# EAGLE design CurrentMeasureOscilloscopeRev.01A  (EAGLE 9.6.2)
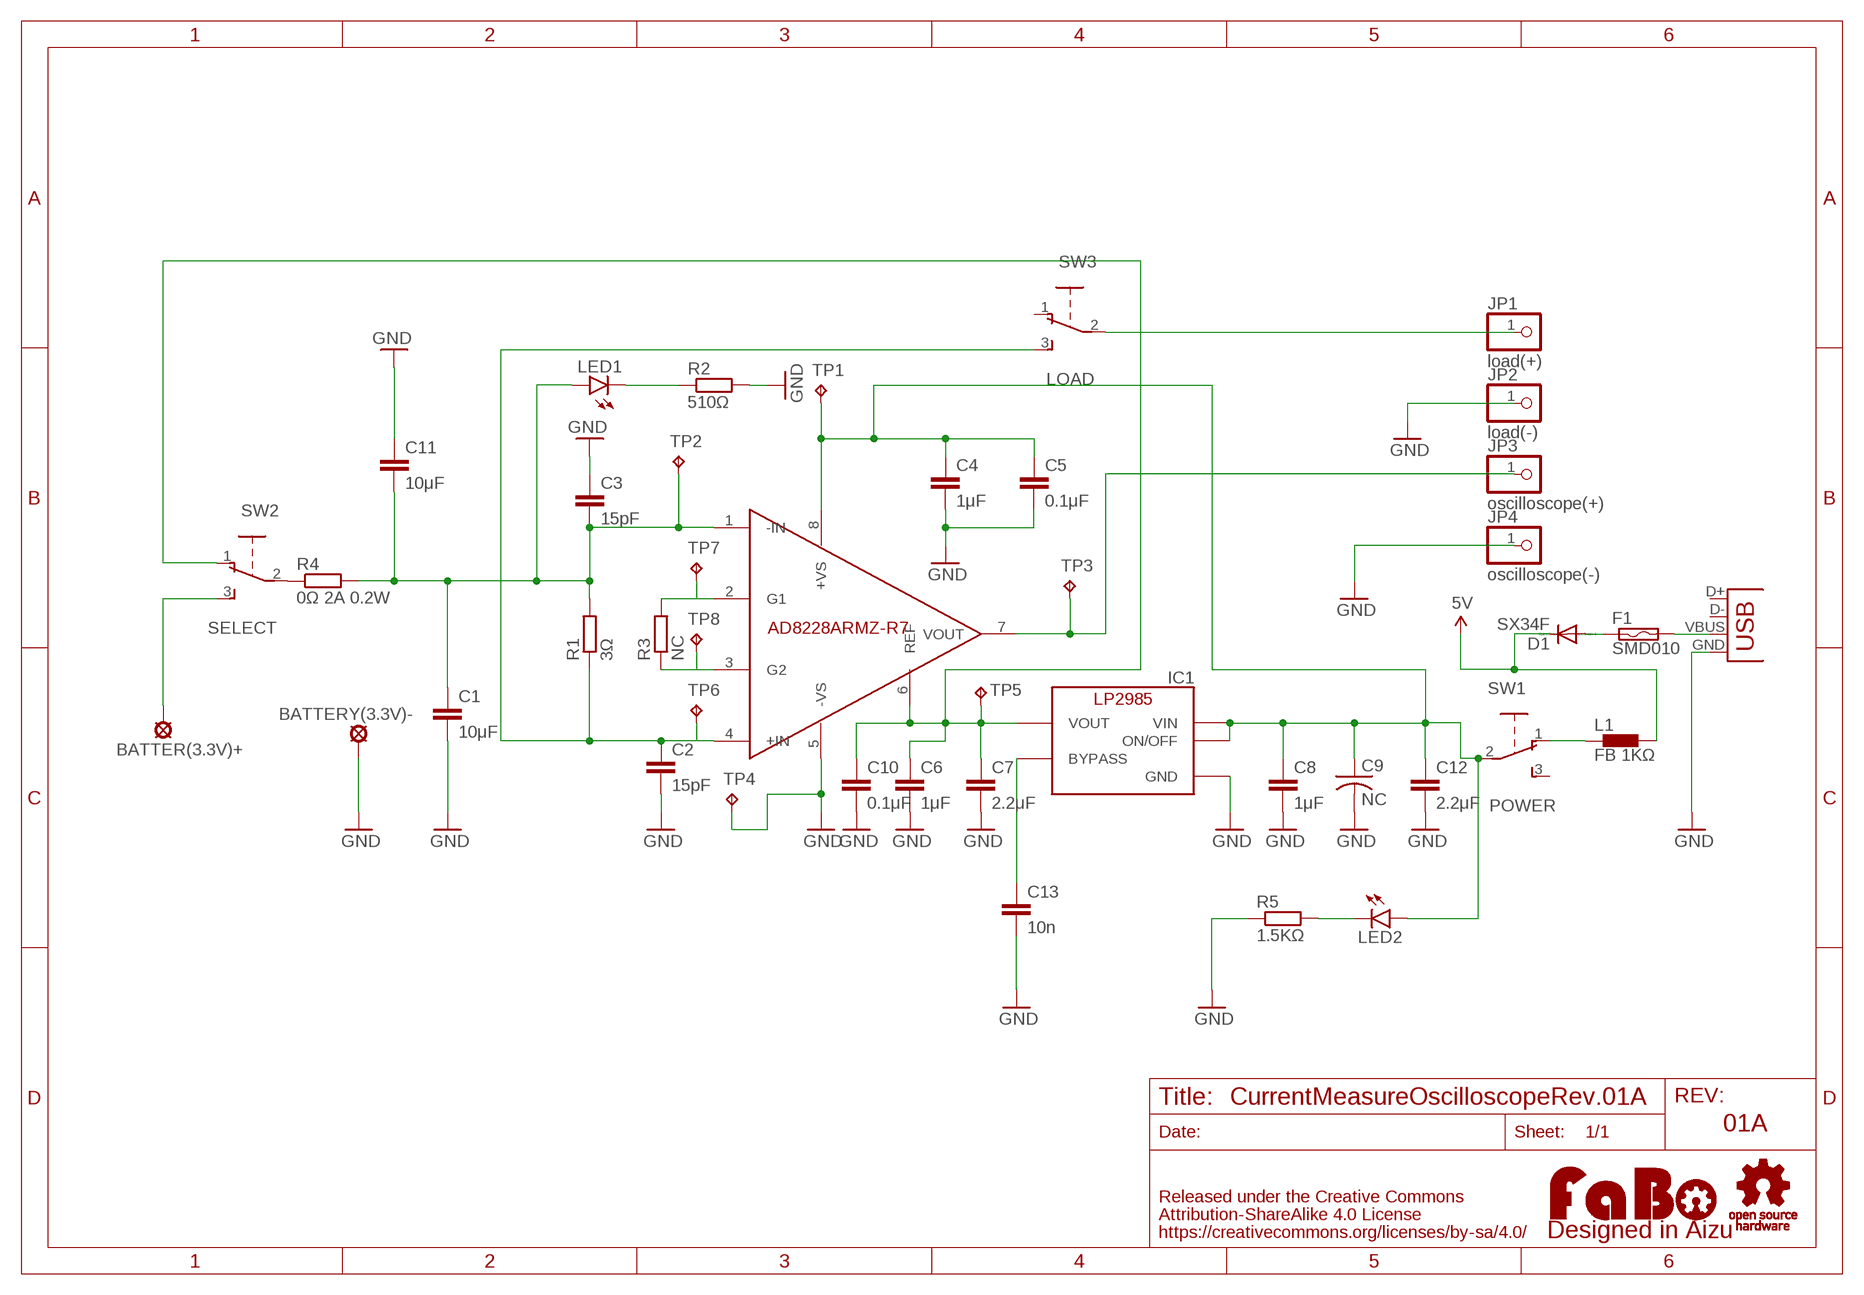
[diagram p0: schematic, sheet 1]

## Parts
BATTER(3.3V)+  SE14  [SE14]
BATTERY(3.3V)-  SE14  [SE14]
C1  10μF  C-EUC0805  [C0805]
C2  15pF  C-EUC0402  [C0402]
C3  15pF  C-EUC0402  [C0402]
C4  1μF  C-EUC0603  [C0603]
C5  0.1μF  C-EUC0402  [C0402]
C6  1μF  C-EUC0805  [C0805]
C7  2.2μF  C-EUC1206K  [C1206K]
C8  1μF  C-EUC0805  [C0805]
C9  NC  C-USC2012  [C2012]
C10  0.1μF  C-EUC0402  [C0402]
C11  10μF  C-EUC0805  [C0805]
C12  2.2μF  C-EUC1206K  [C1206K]
C13  10n  C-EUC2012  [C2012]
D1  SX34F  DIODE-SOD106-R  [SOD106-R]
F1  SMD010  [SMD010]
IC1  TI-LP2985-33DBVR  [TI-LP2985]
JP1  load(+)  PINHD-1X1  [1X01]
JP2  load(-)  PINHD-1X1  [1X01]
JP3  oscilloscope(+)  PINHD-1X1  [1X01]
JP4  oscilloscope(-)  PINHD-1X1  [1X01]
JP5  USB-B-MICRO_SMD  [USB_B_MICRO]
L1  FB 1KΩ  BLM15HB121SN1  [0402]
LED1  LED-EIA0603  [EIA0603-LED]
LED2  LED-EIA0603  [EIA0603-LED]
R1  3Ω  R-EU_M1206  [M1206]
R2  510Ω  R-EU_R0402  [R0402]
R3  NC  R-EU_M1206  [M1206]
R4  0Ω 2A 0.2W  R-EU_R0402  [R0402]
R5  1.5KΩ  R-EU_R0603  [R0603]
SW1  POWER  SWITCH-SLIDE-EG1218  [EG1218]
SW2  SELECT  SWITCH-SLIDE-EG1218  [EG1218]
SW3  LOAD  SWITCH-SLIDE-EG1218  [EG1218]
TP1  TPTP13R  [TP13R]
TP2  TPTP13R  [TP13R]
TP3  TPTP13R  [TP13R]
TP4  TPTP13R  [TP13R]
TP5  TPTP13R  [TP13R]
TP6  TPTP13R  [TP13R]
TP7  TPTP13R  [TP13R]
TP8  TPTP13R  [TP13R]
U1  AD8228ADZY  [MSOP08]
U$2  LOGO_OSHW-M_BOTTOM  [LOGO_OSHW_M_BOTTOM]
U$3  LOGO_FABO-M  [LOGO_FABO_MS]

## Nets
5V: D1.C L1.2
GND: BATTERY(3.3V)-.MP C1.2 C2.2 C3.1 C4.2 C5.2 C6.2 C7.2 C8.2 C9.2 C10.2 C11.1 C12.2 C13.2 IC1.2(GND) JP2.1 JP4.1 JP5.GND R2.2 R5.1 TP4.TP U1.5(-VS)
N$1: C1.1 C3.2 C11.2 LED1.A R1.2 R4.2 TP2.TP U1.1(-IN)
N$2: C4.1 C5.1 C8.1 C9.1 C12.1 IC1.1(VIN) IC1.3(ON/OFF) LED2.A SW1.2 TP1.TP U1.8(+VS)
N$3: C2.1 R1.1 SW3.3 TP6.TP U1.4(+IN)
N$4: LED1.C R2.1
N$5: JP3.1 TP3.TP U1.7(VOUT)
N$6: R3.2 TP7.TP U1.2(G1)
N$7: R3.1 TP8.TP U1.3(G2)
N$8: BATTER(3.3V)+.MP SW2.3
N$9: JP1.1 SW3.2
N$10: R4.1 SW2.2
N$11: C6.1 C7.1 C10.1 IC1.5(VOUT) SW2.1 TP5.TP U1.6(REF)
N$12: C13.1 IC1.4(BYPASS)
N$13: LED2.C R5.2
N$15: L1.1 SW1.1
N$17: D1.A F1.P$1
N$18: F1.P$2 JP5.VBUS
Unconnected: JP5.D+ JP5.D- SW1.3 SW3.1

## Notes on the sheet
- AD8228ARMZ-R7
- 01A

## Library data of the parts
BATTER(3.3V)+ BATTERY(3.3V)- = solpad:SE14: SOLDER PAD E1553, drill 1,4mm, distributor Buerklin, 07F820
C1-C8 C10-C13 = rcl:C-EU: CAPACITOR, European symbol
C9 = rcl:C-US: CAPACITOR, American symbol
D1 = diode:DIODE-: DIODE
F1 = switch-raychem:SMD010
IC1 = FaBo-Supply:TI-LP2985: LP2985
JP1-JP4 = pinhead:PINHD-1X1: PIN HEADER
JP5 = FaBo-etc:USB: USB Female
L1 = inductors:BLM15H: EMIFIL (R) Chip Ferrite Bead for GHz Noise Source: http://www.murata.com/ Ferrite Bead BLM15H.pdf
LED1 LED2 = FaBo-etc:LED: LED
R1-R4 = rcl:R-EU_: RESISTOR, European symbol
R5 = resistor:R-EU_: RESISTOR, European symbol
SW1-SW3 = FaBo-etc:SWITCH-SLIDE
TP1-TP8 = testpad:TP: Test pad
U1 = analog-devices:AD8228ADZY
U$2 = FaBo-Logo:LOGO_OSHW
U$3 = FaBo-Logo:LOGO_FABO

## Board
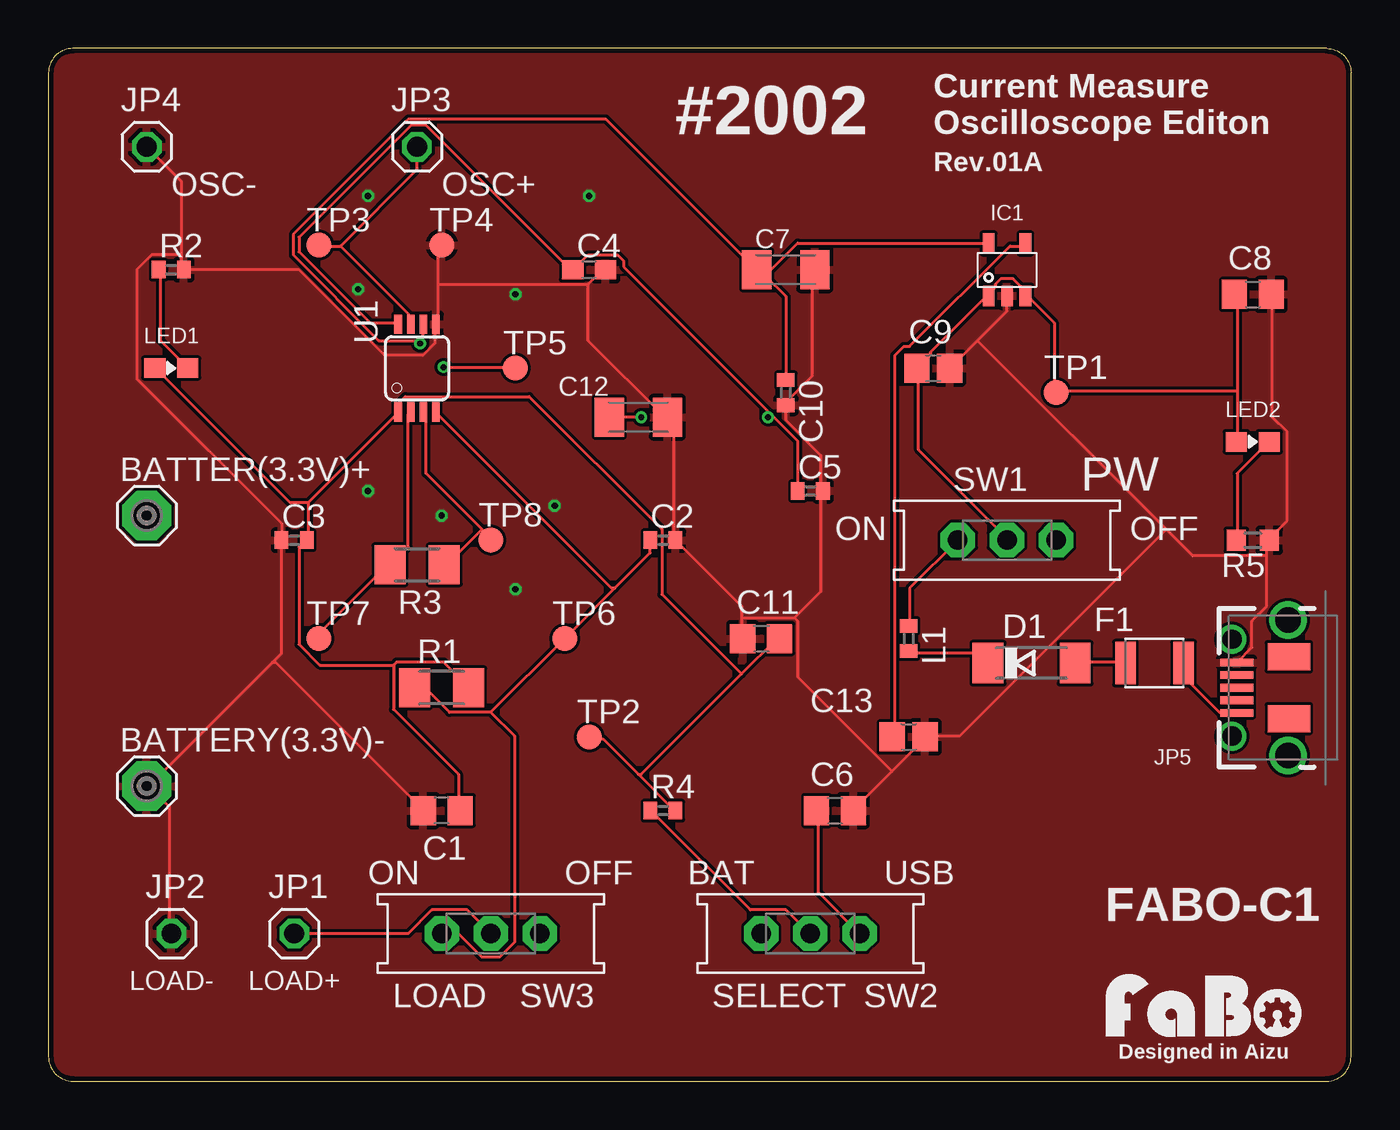
[diagram p1: board, top side]
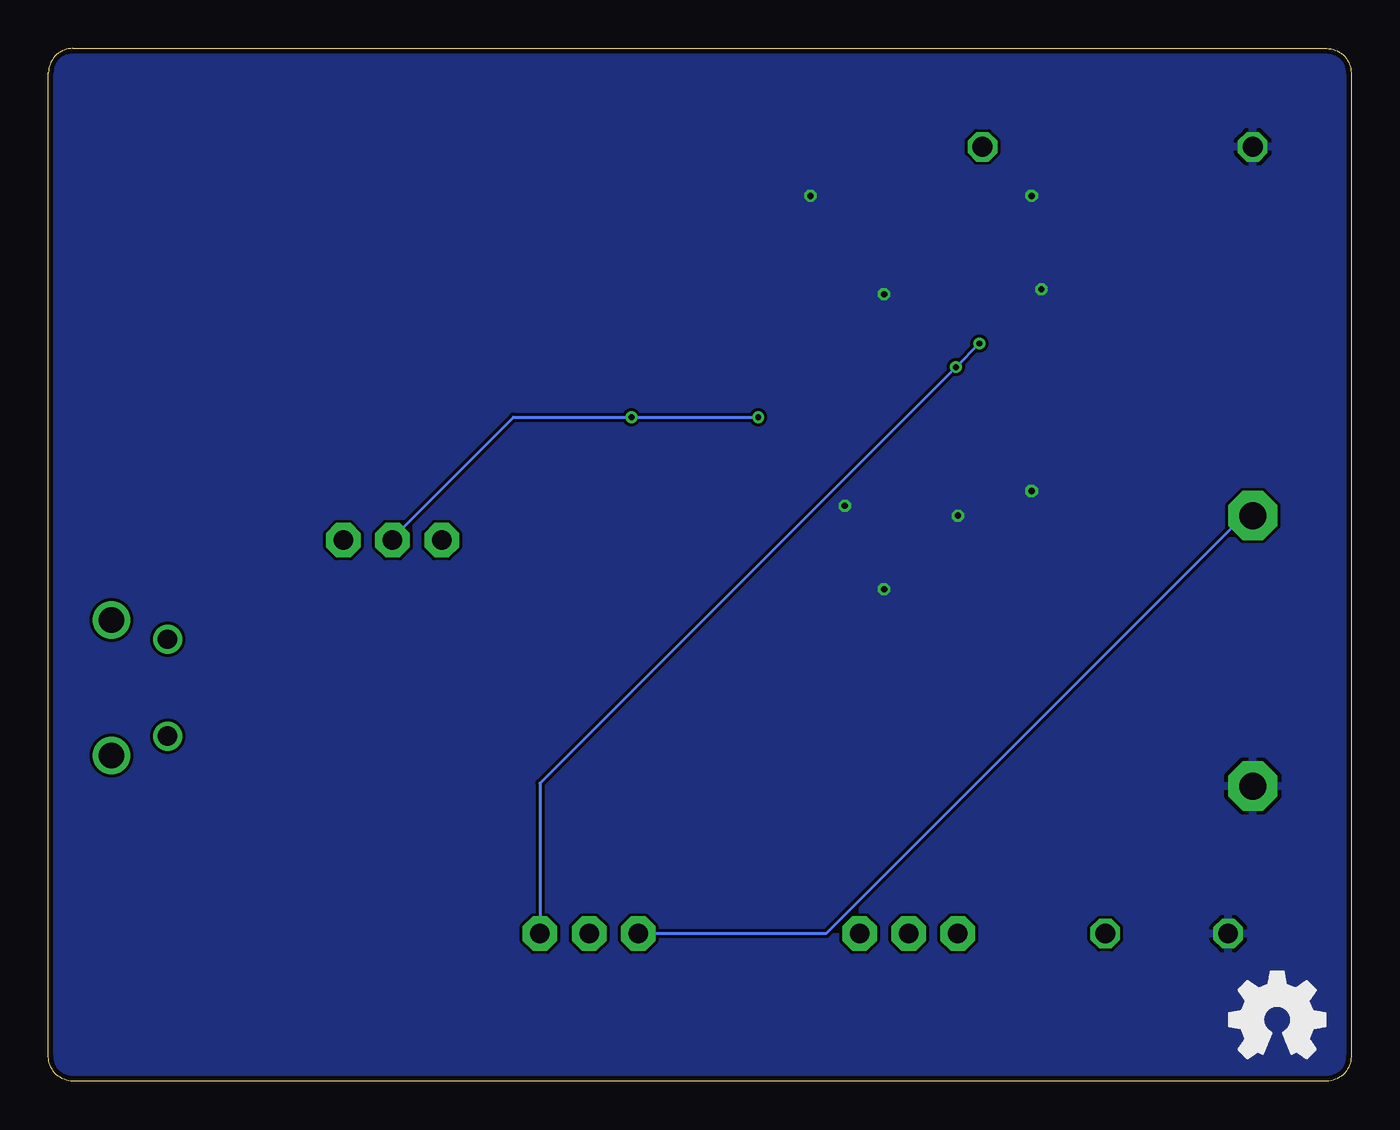
[diagram p2: board, bottom side, seen from below]

Size 67.31 x 53.34 mm. Coordinates in mm from the lower left corner, seen from the top.
Outline: 1.27,0 66.04,0 arc90 67.31,1.27 67.31,52.07 arc90 66.04,53.34 1.27,53.34 arc90 0,52.07 0,1.27 arc90 1.27,0
Copper layers (1*16): Top 0.035mm / dielectric 1.6mm / Bottom 0.035mm
Design rules "PCBway": minimum track width 6mil, minimum drill 12mil, track to track 6mil, track to pad 6mil, pad to pad 6mil, via to via 6mil, smd to smd 6mil, copper to edge 10mil, drill to drill 10mil, minimum pad ring 10mil, minimum via ring 6mil, stop-mask expansion 2mil, vias tented up to drill 100mil, thermal gap 8mil

### Footprints (pad centres in the part's own frame; a part is rotated, then mirrored left to right if it is on the bottom)
SE14 = drill 1.397 pad 2.54 octagon: MP 0,0
C0805 = smd 1.3 x 1.5: 1 -0.95,0; 2 0.95,0
C0402 = smd 0.7 x 0.9: 1 -0.65,0; 2 0.65,0
C0603 = smd 1.1 x 1: 1 -0.85,0; 2 0.85,0
C1206K = smd 1.5 x 2: 1 -1.5,0; 2 1.5,0
C2012 = smd 1.3 x 1.5: 1 -0.85,0; 2 0.85,0
SOD106-R = smd 1.6 x 2.1: A 2.25,0; C -2.25,0
SMD010 = smd 1.067 x 2.184: P$1 -1.5,0; P$2 1.5,0
TI-LP2985 = smd 0.6 x 1.05: 1 -0.95,-1.35; 2 0,-1.35; 3 0.95,-1.35; 4 0.95,1.35; 5 -0.95,1.35
1X01 = drill 1.016 octagon: 1 0,0
USB_B_MICRO = smd 1.7 x 0.4: D+ 2.1,0; D- 2.1,0.65; GND 2.1,-1.3; ID 2.1,-0.65; VBUS 2.1,1.3 | drill 1 pad 1.4: P$1 2.35,2.5; P$2 2.35,-2.5 | drill 1.3 pad 1.7: P$3 -0.55,3.5; P$4 -0.55,-3.5 | smd 2.2 x 1.4: P$6 -0.6,1.6; P$7 -0.6,-1.6
0402 = smd 0.7 x 0.9: 1 -0.65,0; 2 0.65,0
EIA0603-LED = smd 1.1 x 1: A -0.85,0; C 0.85,0
M1206 = smd 1.6 x 2: 1 -1.4,0; 2 1.4,0
R0402 = smd 0.7 x 0.9: 1 -0.65,0; 2 0.65,0
R0603 = smd 1 x 1.1: 1 -0.85,0; 2 0.85,0
EG1218 = drill 1 pad 1.778 octagon: 1 -2.54,0; 2 0,0; 3 2.54,0
TP13R = smd 1.3 x 1.3: TP 0,0
MSOP08 = smd 0.4 x 1: 1 -0.976,-2.263; 2 -0.326,-2.263; 3 0.324,-2.263; 4 0.974,-2.263; 5 0.974,2.262; 6 0.324,2.262; 7 -0.326,2.262; 8 -0.976,2.262

### Placement (x,y rotation side)
BATTER(3.3V)+  5.08,29.21 0 top
BATTERY(3.3V)-  5.08,15.24 0 top
C1  20.32,13.97 180 top
C2  31.75,27.94 0 top
C3  12.7,27.94 0 top
C4  27.94,41.91 0 top
C5  39.37,30.48 0 top
C6  40.64,13.97 0 top
C7  38.1,41.91 0 top
C8  62.23,40.64 0 top
C9  45.72,36.83 0 top
C10  38.1,35.56 270 top
C11  36.83,22.86 0 top
C12  30.48,34.29 0 top
C13  44.45,17.78 0 top
D1  50.8,21.59 0 top
F1  57.15,21.59 0 top
IC1  49.53,41.91 0 top
JP1  12.7,7.62 0 top
JP2  6.35,7.62 0 top
JP3  19.05,48.26 0 top
JP4  5.08,48.26 0 top
JP5  63.5,20.32 180 top
L1  44.45,22.86 270 top
LED1  6.35,36.83 0 top
LED2  62.23,33.02 0 top
R1  20.32,20.32 0 top
R2  6.35,41.91 0 top
R3  19.05,26.67 180 top
R4  31.75,13.97 0 top
R5  62.23,27.94 180 top
SW1  49.53,27.94 0 top
SW2  39.37,7.62 180 top
SW3  22.86,7.62 180 top
TP1  52.07,35.56 0 top
TP2  27.94,17.78 0 top
TP3  13.97,43.18 0 top
TP4  20.32,43.18 0 top
TP5  24.13,36.83 0 top
TP6  26.67,22.86 0 top
TP7  13.97,22.86 0 top
TP8  22.86,27.94 0 top
U1  19.05,36.83 0 top
U$2  3.81,3.17 0 top
U$3  59.69,1.91 0 top

### Tracks (layer width: path | path; a pad name or v marks a point on that pad's centre or on a via)
5V
  Top 0.152: L1.2 44.5,22.1 48.01,22.1 48.46,21.64 D1.C
GND  (via drill 0.32)
  Top 0.152: 5.18,15.24 11.58,21.64 | 11.58,21.64 12.04,22.1 12.04,27.89 C3.1 12.04,28.04 12.04,28.8 4.57,36.27 4.57,41.91 5.33,42.67 6.86,42.67 | 11.58,21.64 11.73,21.64 19.36,14.02 C1.2 | 5.18,15.24 6.25,14.17 6.25,7.62 JP2.1 | 5.18,15.24 BATTERY(3.3V)-.MP | IC1.2 49.53,39.78 48.01,38.25 | 48.01,38.25 46.63,36.88 C9.2 | 62.94,27.13 62.94,24.54 62.18,23.77 62.18,22.4 61.42,21.64 JP5.GND | 62.94,27.13 62.94,27.89 R5.1 63.09,28.04 64.01,28.96 64.01,33.53 63.25,34.29 63.25,40.54 C8.2 | 57.76,28.5 59.13,27.13 62.94,27.13 | 57.76,28.5 48.01,38.25 | 6.86,42.67 6.86,46.48 JP4.1 | 6.86,42.67 6.86,41.91 R2.2 12.95,41.91 17.37,37.49 19.36,37.49 19.96,38.1 19.96,39.01 U1.5 20.12,39.17 20.12,41.15 | 20.12,41.15 20.12,42.98 TP4.TP | 27.89,41.15 28.65,41.91 C4.2 | 20.12,41.15 27.89,41.15 | 39.93,30.48 39.93,32.31 38.1,34.14 C10.2 38.1,35.05 39.47,36.42 39.47,41.91 C7.2 | 43.59,16 45.26,17.68 C13.2 45.41,17.83 47.09,17.83 57.76,28.5 | 43.59,16 41.6,14.02 C6.2 | 35.81,23.93 35.81,24.54 32.46,27.89 C2.2 32.31,28.04 32.31,33.98 32,34.29 C12.2 31.85,34.29 27.89,38.25 27.89,41.15 | 35.81,23.93 35.81,22.86 C11.1 | 43.59,16 38.71,20.88 38.71,23.77 38.56,23.93 | 35.81,23.93 38.56,23.93 | 39.93,30.48 39.93,25.3 38.56,23.93 | 39.93,30.48 C5.2
  other vias: 24.13,40.64 27.94,45.72 24.13,25.4 16.51,30.48 20.32,29.21 26.16,29.72 16.51,45.72 16,40.89
  pour Top: 0,0 67.31,0 67.31,53.34 0,53.34
  pour Bottom: 0,0 67.31,0 67.31,53.34 0,53.34
N$1
  Top 0.152: 30.48,15.85 28.65,17.68 28.04,17.68 TP2.TP | 30.48,15.85 32.31,14.02 R4.2 | 35.81,21.03 30.63,15.85 30.48,15.85 | 35.81,21.03 37.64,22.86 C11.2 | 17.83,21.49 17.83,19.2 21.18,15.85 21.18,14.02 C1.1 | 17.83,21.49 17.98,21.64 20.42,21.64 21.64,20.42 R1.2 | 13.41,29.87 13.41,28.04 C3.2 13.26,27.89 12.95,27.58 12.95,22.55 14.02,21.49 17.83,21.49 | 13.41,29.87 17.98,34.44 U1.1 18.14,34.59 18.14,35.05 18.44,35.36 24.84,35.36 31.7,28.5 31.7,25.15 35.81,21.03 | 13.41,29.87 12.5,29.87 5.64,36.73 LED1.A
N$2  (via drill 0.3)
  Top 0.152: 37.34,34.44 29.72,42.06 29.72,42.37 29.41,42.67 27.89,42.67 27.13,41.91 C4.1 26.98,41.91 19.51,49.38 18.75,49.38 12.95,43.59 12.95,42.82 16.61,39.17 17.98,39.17 U1.8 | 37.34,34.44 38.71,33.07 C5.1 | 61.42,35.66 61.42,40.54 C8.1 | 61.42,35.66 61.42,33.07 LED2.A | 61.42,35.66 52.12,35.66 TP1.TP 51.97,35.66 51.97,39.17 50.6,40.54 IC1.3 50.6,40.69 49.84,41.45 49.23,41.45 48.92,41.15 48.92,41 48.62,40.69 IC1.1 48.46,40.54 45.57,37.64 45.57,37.49 44.96,36.88 C9.1 44.96,36.73 44.96,32.61 49.53,28.04 SW1.2 | v30.63,34.29 C12.1 | v37.19,34.29 37.34,34.44
  Bottom 0.152: v30.63,34.29 v37.19,34.29 43.28,34.29 49.53,28.04 SW1.2
N$3
  Top 0.152: 29.26,25.45 TP6.TP 22.86,19.05 | 29.26,25.45 31.09,27.28 31.09,27.89 C2.1 | 29.26,25.45 29.11,25.45 20.12,34.44 U1.4 | 22.86,19.05 20.73,19.05 19.51,20.27 19.05,20.27 R1.1 | SW3.3 21.18,7.62 22.4,6.4 23.32,6.4 24.08,7.16 24.08,17.83 22.86,19.05
N$4
  Top 0.152: R2.1 5.79,41.91 5.79,38.25 7.16,36.88 LED1.C
N$5
  Top 0.152: 15.09,43.13 18.59,39.62 18.59,39.17 U1.7 | 15.09,43.13 14.02,43.13 TP3.TP | JP3.1 19.05,47.09 15.09,43.13
N$6
  Top 0.152: U1.2 18.59,34.44 18.59,27.58 17.68,26.67 R3.2 17.53,26.67 14.02,23.16 14.02,22.86 TP7.TP
N$7
  Top 0.152: 22.4,28.5 22.86,28.04 TP8.TP | 22.4,28.5 19.51,31.39 19.51,34.44 U1.3 | 22.4,28.5 20.57,26.67 R3.1
N$8
  Bottom 0.152: SW2.3 27.13,7.62 5.64,29.11 5.18,29.11 BATTER(3.3V)+.MP
N$9
  Top 0.152: JP1.1 18.59,7.62 19.81,8.84 21.64,8.84 SW3.2
N$10
  Top 0.152: R4.1 31.24,13.87 36.27,8.84 38.1,8.84 39.32,7.62 SW2.2
N$11  (via drill 0.3)
  Top 0.152: SW2.1 39.78,9.75 39.78,13.87 C6.1 | C10.1 38.1,40.54 37.03,41.6 | 37.03,41.6 36.73,41.91 C7.1 | 19.05,38.25 19.36,38.56 19.36,39.01 U1.6 | 19.05,38.25 17.07,38.25 12.65,42.67 12.65,43.74 18.59,49.68 28.8,49.68 36.58,41.91 C7.1 | 37.03,41.6 38.71,43.28 48.46,43.28 IC1.5 | 37.03,41.6 C7.1 | v20.42,36.88 24.08,36.88 TP5.TP | 19.05,38.25 v19.2,38.1
  Bottom 0.152: v19.2,38.1 v20.42,36.88 41.91,15.39 SW2.1
N$12
  Top 0.152: IC1.4 50.44,43.13 49.68,43.13 44.5,37.95 44.2,37.95 43.74,37.49 43.74,17.83 C13.1
N$13
  Top 0.152: R5.2 61.42,28.04 61.42,31.39 62.94,32.92 LED2.C
N$15
  Top 0.152: SW1.1 44.5,25.45 44.5,23.62 L1.1
N$17
  Top 0.152: D1.A 53.19,21.64 55.63,21.64 F1.P$1
N$18
  Top 0.152: JP5.VBUS 61.27,19.05 60.5,19.05 58.67,20.88 58.67,21.49 F1.P$2

### Text on the board
tPlace: #2002 | Current Measure / Oscilloscope Editon | Rev.01A | OSC- | OSC+ | PW | ON | OFF | ON | OFF | BAT | USB | FABO-C1 | LOAD- | LOAD+ | LOAD | SELECT | Designed in Aizu